# Altium project SEMA_V7 Motor Controller4.12.PrjPcb (part 2 of 2)

## Sheet MOSFET and current Sense.SchDoc
size 431 x 279 mm; SheetNumber: 5; SheetTotal: 6
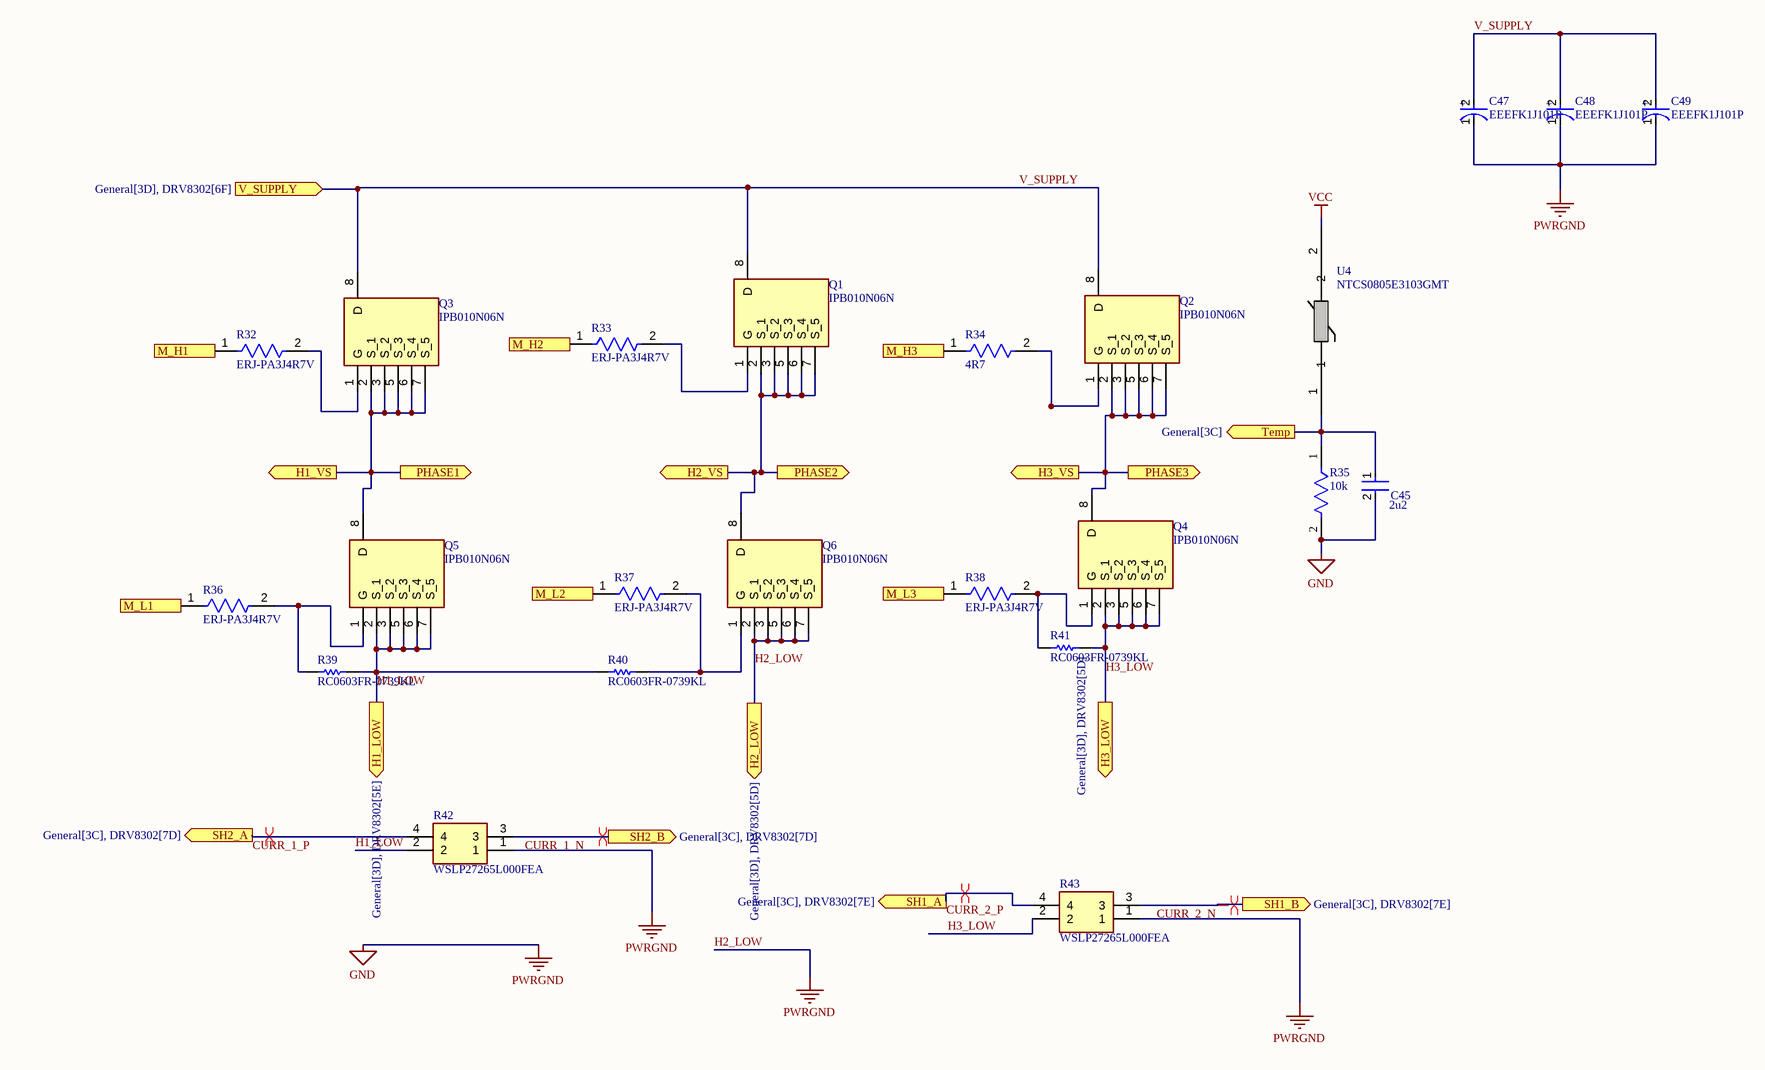
[diagram p3: MOSFET and current Sense.SchDoc]

### Parts
C45  2u2  [FP-GRM188-0_1-e0_2_0_5-MFG]
C47  EEEFK1J101P  [FP-FKG-MFG]
C48  EEEFK1J101P  [FP-FKG-MFG]
C49  EEEFK1J101P  [FP-FKG-MFG]
Q1  IPB010N06N  [PG-TO263-7-3_3]
Q2  IPB010N06N  [PG-TO263-7-3_3]
Q3  IPB010N06N  [PG-TO263-7-3_3]
Q4  IPB010N06N  [PG-TO263-7-3_3]
Q5  IPB010N06N  [PG-TO263-7-3_3]
Q6  IPB010N06N  [PG-TO263-7-3_3]
R32  ERJ-PA3J4R7V  [FP-ERJPA3-IPC_C]
R33  ERJ-PA3J4R7V  [FP-ERJPA3-IPC_C]
R34  4R7  [FP-ERJPA3-IPC_C]
R35  10k  [FP-ERA3A-IPC_C]
R36  ERJ-PA3J4R7V  [FP-ERJPA3-IPC_C]
R37  ERJ-PA3J4R7V  [FP-ERJPA3-IPC_C]
R38  ERJ-PA3J4R7V  [FP-ERJPA3-IPC_C]
R39  RC0603FR-0739KL  [RESC1608X55X25LL10T15]
R40  RC0603FR-0739KL  [RESC1608X55X25LL10T15]
R41  RC0603FR-0739KL  [RESC1608X55X25LL10T15]
R42  WSLP27265L000FEA  [WSLP27265L000FEA]
R43  WSLP27265L000FEA  [WSLP27265L000FEA]
U4  NTCS0805E3103GMT  [NTCS0805_VIS]

### Ports
H1_LOW (out, see General[3D], DRV8302[5E]), H1_VS (out, see General[3D], DRV8302[4C]), H2_LOW (out, see General[3D], DRV8302[5D]), H2_VS (out, see General[3D], DRV8302[4C]), H3_LOW (out, see General[3D], DRV8302[5D]), H3_VS (out, see General[3D], DRV8302[4C]), M_H1 (in, see General[3D], DRV8302[5E]), M_H2 (in, see General[3D], DRV8302[5E]), M_H3 (in, see General[3D], DRV8302[5D]), M_L1 (in, see General[3D], DRV8302[5E]), M_L2 (in, see General[3D], DRV8302[5D]), M_L3 (in, see General[3D], DRV8302[5D]), PHASE1 (out, see General[2D]), PHASE2 (out, see General[2D]), PHASE3 (out, see General[2D]), SH1_A (out, see General[3C], DRV8302[7E]), SH1_B (out, see General[3C], DRV8302[7E]), SH2_A (out, see General[3C], DRV8302[7D]), SH2_B (out, see General[3C], DRV8302[7D]), Temp (out, see General[3C]), V_SUPPLY (in, see General[3D], DRV8302[6F])

### Nets
H2_LOW: C45.2 C47.1(C) C48.1(C) C49.1(C) Q6.2(S_1) Q6.3(S_2) Q6.5(S_3) Q6.6(S_4) Q6.7(S_5) R35.2 R42.1 R43.1 ; port H2_LOW  [also labelled GND, PWRGND]
VCC: U4.2
CURR_1_N: R42.3 ; port SH2_B
CURR_1_P: R42.4 ; port SH2_A
CURR_2_N: R43.3 ; port SH1_B
CURR_2_P: R43.4 ; port SH1_A
H1_LOW: Q5.2(S_1) Q5.3(S_2) Q5.5(S_3) Q5.6(S_4) Q5.7(S_5) R39.2 R40.1 R42.2 ; port H1_LOW
H1_VS: Q3.2(S_1) Q3.3(S_2) Q3.5(S_3) Q3.6(S_4) Q3.7(S_5) Q5.8(D) ; port H1_VS, port PHASE1
H2_VS: Q1.2(S_1) Q1.3(S_2) Q1.5(S_3) Q1.6(S_4) Q1.7(S_5) Q6.8(D) ; port H2_VS, port PHASE2
H3_LOW: Q4.2(S_1) Q4.3(S_2) Q4.5(S_3) Q4.6(S_4) Q4.7(S_5) R41.2 R43.2 ; port H3_LOW
H3_VS: Q2.2(S_1) Q2.3(S_2) Q2.5(S_3) Q2.6(S_4) Q2.7(S_5) Q4.8(D) ; port H3_VS, port PHASE3
V_SUPPLY: C47.2(A) C48.2(A) C49.2(A) Q1.8(D) Q2.8(D) Q3.8(D) ; port V_SUPPLY
NetC45_1: C45.1 R35.1 U4.1 ; port Temp
NetQ1_1: Q1.1(G) R33.2
NetQ2_1: Q2.1(G) R34.2
NetQ3_1: Q3.1(G) R32.2
NetQ4_1: Q4.1(G) R38.2 R41.1
NetQ5_1: Q5.1(G) R36.2 R39.1
NetQ6_1: Q6.1(G) R37.2 R40.2
NetR32_1: R32.1 ; port M_H1
NetR33_1: R33.1 ; port M_H2
NetR34_1: R34.1 ; port M_H3
NetR36_1: R36.1 ; port M_L1
NetR37_1: R37.1 ; port M_L2
NetR38_1: R38.1 ; port M_L3

### Layout directives
differential pair: CURR_1_N, CURR_1_P, CURR_2_N, CURR_2_P

### Notes on the sheet
- DWG. NO.
- REV.
- SHT.
- THIS DOCUMENT AND THE DATA DISCLOSED HEREIN OR HEREWITH IS THE PROPERTY OF ALTIUM LIMITED AND MAY BE FREELY DISTRIBUTED IN WHOLE. NO RIGHTS ARE RESERVED OR EXPRESS OR IMPLIED WARANTEE GIVEN.
- REVISION
- DESCRIPTION
- DATE
- APPROVED
- ENG:
- APPROVALS
- PROJECT
- DSN:
- CHK:
- REFERENCE DOCUMENTS
- PROJECT REVISION:
- TITLE
- DOCUMENT REVISION:
- DESIGN ITEM:
- BOM:
- FAB DWG:
- PCB DWG:
- ASSY DWG:
- SCALE:
- SIZE
- B
- CAGE CODE
- FILE NAME
- DWG NO.
- SHEET
- OF
- REV
- (in symbol CMP-05427-000067-1) +

### Library data of the parts
C45 = CMP-2006-02836-2: Chip Multilayer Ceramic Capacitors for General Purpose, 0603, 2.2uF, X7R, 15%, 10%, 10V; Case Code (Metric): 1608; Height: 0.8mm; Packaging: Cut Tape; Voltage: 10V; Lead Free: Lead Free; Min Operating Temperature: -55°C; Voltage Rating (DC): 10V; Max Operating Temperature: 125°C; Voltage Rating: 10V; Dielectric: X7R; Depth: 0.8mm; Case Code (Imperial): 0603; Termination: SMD/SMT; Case/Package: 0603; Number of Pins: 2; REACH SVHC: No SVHC; Mount: Surface Mount; Width: 0.031inch; Material: Ceramic; Capacitance: 2.2uF; Package Quantity: 1; Weight: 7.1E-05oz; Length: 1.6mm; Thickness: 0.035inch; Tolerance: 10%
C47-C49 = CMP-05427-000067-1: CAP ALUM 100UF 20% 63V SMD; Material: Aluminium; ESR (Equivalent Series Resistance): 350mR; Life (Hours): 2000Hour; Ripple Current (AC): 400mA; Leakage Current: 3uA; Polarity: Polar; Lead Free: Lead Free; Impedance: 350mR; Packaging: Tape and Reel; Voltage Rating (DC): 63V; Construction: Cylindrical; Ripple Current: 400mA; Min Operating Temperature: -55°C; RoHS Compliant: Yes; Dielectric Material: Aluminium; Termination: SMD/SMT; REACH SVHC: No SVHC; Mount: Surface Mount; Radiation Hardening: No; Width: 12mm; Voltage Rating: 63V; Length: 10.2mm; Voltage: 63V; Tolerance: 20%; Series: FK; Diameter: 10mm; Height: 10.2mm; Max Operating Temperature: 105°C; Capacitance: 100uF; Height - Seated (Max): 0.413inch; Case/Package: Radial; Package Quantity: 1; Contact Plating: Tin
Q1-Q6 = IPB010N06N: MOSFET (N-Channel); Manufacturer_Name: Infineon; Datasheet Link: https://www.infineon.com/dgdl/Infineon-IPB010N06N-DS-v02_04-EN.pdf?fileId=db3a3043353fdc1601355341f17a485f; Manufacturer_Part_Number: IPB010N06N; Mouser Part Number: 726-IPB010N06N; Mouser Price/Stock: https://www.mouser.co.uk/ProductDetail/Infineon-Technologies/IPB010N06N?qs=EUA%2Fg8wssK3txpgcjG7wiw%3D%3D
R32-R34 R36-R38 = CMP-05422-000119-1: RES SMD 4.7 OHM 5% 1/4W 0603; Max Power Dissipation: 250mW; Temperature Coefficient: 200ppm/°C; Resistance: 4.7R; Number of Terminations: 2; Resistor Type: Thick Film; Width: 0.031inch; Features: Automotive AEC-Q200; Case/Package: 0603; Height: 0.018inch; Length: 0.063inch; Max Operating Temperature: 155°C; Min Operating Temperature: -55°C; Case Code (Imperial): 0603; Packaging: Tape and Reel; Case Code (Metric): 1608; Tolerance: 5%
R35 = CMP-2000-00874-2: RES SMD 10K OHM 0.1% 1/10W 0603; Voltage Rating (DC): 75V; Power Rating: 100mW; Resistance: 10kR; Temperature Coefficient: 25ppm/°C; Radiation Hardening: No; Width: 0.8mm; Depth: 0.8mm; Construction: Rectangular; Case Code (Metric): 1608; Package Quantity: 5000; Length: 1.6mm; Size Code: 0603; Case Code (Imperial): 0603; Termination: SMD/SMT; Contact Plating: Tin; Resistance Tolerance: 0.1%; Military Standard: Not; Packaging: Tape and Reel; Max Power Dissipation: 100mW; REACH SVHC: No SVHC; Series: ERA-3A; Voltage Rating: 75V; Lead Free: Lead Free; Technology: METAL FILM; RoHS Compliant: Yes; Max Operating Temperature: 155°C; Resistor Type: Thin Film; Min Operating Temperature: -55°C; Number of Pins: 2; Case/Package: 0603; Tolerance: 0.1%; Height: 0.45mm; Mount: Surface Mount; Number of Terminations: 2
R39-R41 = CMP-2000-06940-1: Chip Resistor, 39 KOhm, +/- 1%, 0.1 W, -55 to 155 degC, 0603 (1608 Metric), RoHS, Tape and Reel; Manufacturer: Yageo; Resistance: 39kOhms; Voltage Rating: 50V; Power Rating: 100mW; Temperature Coefficient: 100PPM/C; Product: ThickFilmResistorsGeneralPurpose; Case Code - in: 0603; Tolerance: 1%; Operating Temperature Range: -55Cto+155C; Series: RC; Package Description: 2-Pin Surface Mount Device, Body 1.6 x 0.8 mm; Datasheet URL: http://www.yageo.com/documents/recent/PYu-RC_Group_51_RoHS_L_7.pdf; Package Reference: 0603; Case Code - mm: 1608; Datasheet Version: Rev. 7, 05/2017; Mounting Technology: SurfaceMount; Packaging: Reel; Manufacturer URL: http://www.yageo.com/; Termination Style: SMD/SMT
R42 R43 = WSLP27265L000FEA: Resistor; Manufacturer_Name: Vishay; Datasheet Link: https://componentsearchengine.com/Datasheets/1/WSLP27265L000FEA.pdf; Height: 2.81mm; Manufacturer_Part_Number: WSLP27265L000FEA; Mouser Part Number: 71-WSLP27265L000FEA; Mouser Price/Stock: https://www.mouser.co.uk/ProductDetail/Vishay-Dale/WSLP27265L000FEA?qs=h6V4JsTaLXeHJBxiH6kbIg%3D%3D
U4 = CMP-00030-42801496-1: NTCS0805E3103GMT Thermistor NTC 10K Ohm 2% 2-Pin 0805 Surface Mount Solder Pad 3570K -4 to -3.5 T/R Automotive; Accuracy: 3%; Power Rating: 210mW; Resistance: 10kΩ; Length: 2mm; Schedule B: 8533400080, 8533400080; Radiation Hardening: No; Case Code (Metric): 2012; Packaging: Digi-Reel®; Mount: Surface Mount; Max Operating Temperature: 150°C; Case Code (Imperial): 0805; Tolerance: 2%; Termination: SMD/SMT; Depth: 1.25mm; Max Power Dissipation: 210mW; Contact Plating: Tin; NexarPartId: 42801496; Min Operating Temperature: -40°C; Number of Pins: 2; RoHS: Compliant; Case/Package: 0805

## Sheet HALL_SENSOR_FILTER.SchDoc
size 431 x 279 mm; SheetNumber: 3; SheetTotal: 6
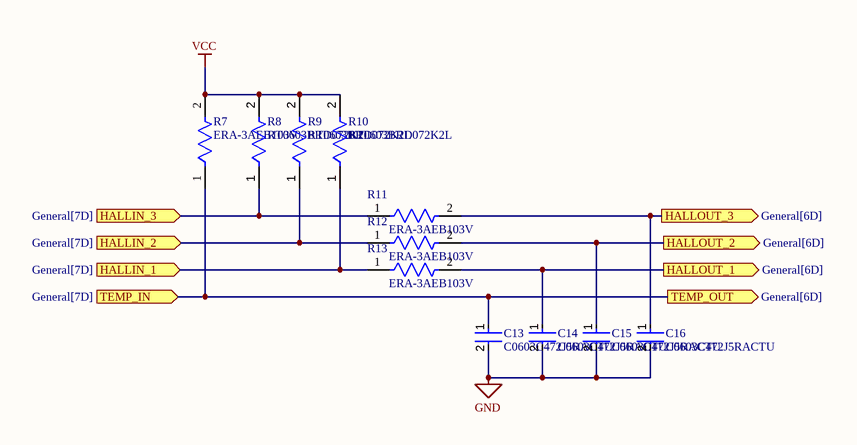
[diagram p4: HALL_SENSOR_FILTER.SchDoc]

### Parts
C13  C0603C472J5RACTU  [FP-C0603C-CF-MFG]
C14  C0603C472J5RACTU  [FP-C0603C-CF-MFG]
C15  C0603C472J5RACTU  [FP-C0603C-CF-MFG]
C16  C0603C472J5RACTU  [FP-C0603C-CF-MFG]
R7  ERA-3AEB103V  [FP-ERA3A-IPC_C]
R8  RT0603BRD072K2L  [FP-RT0603-MFG]
R9  RT0603BRD072K2L  [FP-RT0603-MFG]
R10  RT0603BRD072K2L  [FP-RT0603-MFG]
R11  ERA-3AEB103V  [FP-ERA3A-IPC_C]
R12  ERA-3AEB103V  [FP-ERA3A-IPC_C]
R13  ERA-3AEB103V  [FP-ERA3A-IPC_C]

### Ports
HALLIN_1 (in, see General[7D]), HALLIN_2 (in, see General[7D]), HALLIN_3 (in, see General[7D]), HALLOUT_1 (out, see General[6D]), HALLOUT_2 (out, see General[6D]), HALLOUT_3 (out, see General[6D]), TEMP_IN (in, see General[7D]), TEMP_OUT (out, see General[6D])

### Nets
GND: C13.2 C14.2 C15.2 C16.2  [project net H2_LOW]
VCC: R7.2 R8.2 R9.2 R10.2
NetC13_1: C13.1 R7.1 ; port TEMP_IN, port TEMP_OUT
NetC14_1: C14.1 R13.2 ; port HALLOUT_1
NetC15_1: C15.1 R12.2 ; port HALLOUT_2
NetC16_1: C16.1 R11.2 ; port HALLOUT_3
NetJ3_2: R10.1 R13.1 ; port HALLIN_1
NetJ3_3: R9.1 R12.1 ; port HALLIN_2
NetJ3_4: R8.1 R11.1 ; port HALLIN_3

### Notes on the sheet
- DWG. NO.
- REV.
- SHT.
- THIS DOCUMENT AND THE DATA DISCLOSED HEREIN OR HEREWITH IS THE PROPERTY OF ALTIUM LIMITED AND MAY BE FREELY DISTRIBUTED IN WHOLE. NO RIGHTS ARE RESERVED OR EXPRESS OR IMPLIED WARANTEE GIVEN.
- REVISION
- DESCRIPTION
- DATE
- APPROVED
- ENG:
- APPROVALS
- PROJECT
- DSN:
- CHK:
- REFERENCE DOCUMENTS
- PROJECT REVISION:
- TITLE
- DOCUMENT REVISION:
- DESIGN ITEM:
- BOM:
- FAB DWG:
- PCB DWG:
- ASSY DWG:
- SCALE:
- SIZE
- B
- CAGE CODE
- FILE NAME
- DWG NO.
- SHEET
- OF
- REV

### Library data of the parts
C13-C16 = CMP-1035-02202-3: C0603C 4.7nF Ceramic Multilayer Capacitor; 50 VDC; +125degC; X7R Dielec; +/-5%; Manufacturer: KEMET; Tolerance: 0.05; Capacitance: 4,700 pF; Temperature Coefficient: 30ppm/°C; Value: 4,700 pF; Automotive Grade: Grade 1; Voltage Rating: 50 V; Description: C0603 4,700 pF X7R 30ppm/°C 5.00% 50 V; Device Class L2: Capacitors; Temperature Range Low: -55°C; Automotive: Yes; Manufacturer Part Number: C0603C472J5RACTU; Height: 0.87mm; ComponentLink2Description: Datasheet; Mouser Description: Multilayer Ceramic Capacitors MLCC - SMD/SMT 50volts 4700pF X7R 5%; Material: Ceramic; Device Class L3: Ceramic Capacitors; Device Class L1: Passive Components; Category: Cap; Temperature: -55°C to +125°C; Octopart: https://octopart.com/c0603c472j5ractu-kemet-107195; Digikey Description: C0603C 4.7nF Ceramic Multilayer Capacitor; 50 VDC; +125degC; X7R Dielec; +/-5%; Package: C0603C-CF; Lead Free: Yes; RoHS: TRUE; ComponentLink2URL: https://api.kemet.com/component-edge/download/datasheet/C0603C100J5GACAUTO.pdf; Temperature Range High: +125°C; Temperature Characteristic: X7R
R7 R11-R13 = CMP-2000-00874-2: as R35 on sheet MOSFET and current Sense; Radiation Hardening: No; Width: 0.8mm; Depth: 0.8mm; Construction: Rectangular; Case Code (Metric): 1608; Package Quantity: 5000; Length: 1.6mm; Size Code: 0603; Case Code (Imperial): 0603; Termination: SMD/SMT; Contact Plating: Tin; Resistance Tolerance: 0.1%; Military Standard: Not; Packaging: Tape and Reel; Max Power Dissipation: 100mW; REACH SVHC: No SVHC; Series: ERA-3A; Voltage Rating: 75V; Lead Free: Lead Free; Technology: METAL FILM; RoHS Compliant: Yes; Max Operating Temperature: 155°C; Resistor Type: Thin Film; Min Operating Temperature: -55°C; Number of Pins: 2; Case/Package: 0603; Tolerance: 0.1%; Height: 0.45mm; Mount: Surface Mount; Number of Terminations: 2
R8-R10 = CMP-2000-04423-2: RES 2.20K OHM 1/10W .1% SMD 0603; Manufacturer: Yageo; Power Rating: 0.1W; Tolerance: 0.001; Value: 2.2KΩ; Voltage Rating: 75V; Temperature Coefficient: 25 ppm/°C; Description: RT0603 2.2KΩ 0.1W 25 ppm/°C 0.10%; Series: RT; Manufacturer Part Number: RT0603BRD072K2L; ComponentLink2URL: http://www.yageo.com/documents/recent/PYu-RT_1-to-0.01_RoHS_L_9.pdf; Octopart: https://octopart.com/rt0603brd072k2l-yageo-1186019; Digikey Description: RES 2.20K OHM 1/10W .1% SMD 0603; Device Class L1: Passive Components; Temperature: -55°C to +155°C; ComponentLink2Description: Datasheet; Mouser Description: High Precision-High Stability Chip Resistor Thin Film 0603 2.2kOhm 0.1% Paper T/R; RoHS: TRUE; Footprint Url: http://www.yageo.com/exep/pages/download/literatures/PYu-R_Mount_10.pdf; Height: 0.55mm; Device Class L2: Resistors; Temperature Range Low: -55°C; Ipc Land Pattern Name: RESC16080X45; Composition: Thin Film; Lead Free: Yes; Temperature Range High: +155°C; Category: Res; Automotive: No; Resistance: 2.2KΩ; Package: RT0603; Device Class L3: Chip SMD Resistors

## Sheet CAn tranceiver.SchDoc
size 431 x 279 mm; SheetNumber: 6; SheetTotal: 6
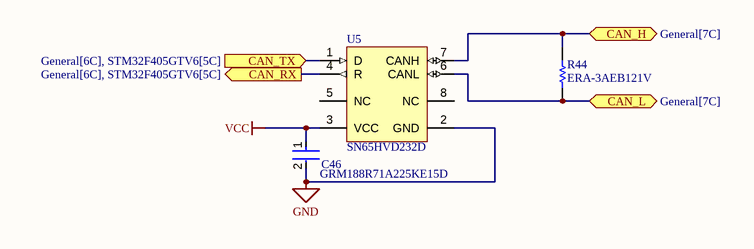
[diagram p5: CAn tranceiver.SchDoc]

### Parts
C46  GRM188R71A225KE15D  [FP-GRM188-0_1-e0_2_0_5-MFG]
R44  ERA-3AEB121V  [RESC1608X55X30NL20T20]
U5  SN65HVD232D  [D0008A_L]

### Ports
CAN_H (bidir, see General[7C]), CAN_L (bidir, see General[7C]), CAN_RX (out, see General[6C], STM32F405GTV6[5C]), CAN_TX (in, see General[6C], STM32F405GTV6[5C])

### Nets
GND: C46.2 U5.2(GND)  [project net H2_LOW]
VCC: C46.1 U5.3(VCC)
CAN_N: R44.2 U5.6(CANL) ; port CAN_L
CAN_P: R44.1 U5.7(CANH) ; port CAN_H
NetU1_61: U5.4(R) ; port CAN_RX
NetU1_62: U5.1(D) ; port CAN_TX

Not connected (* = marked no-connect by the designer): U5 5(NC) 8(NC)

### Notes on the sheet
- DWG. NO.
- REV.
- SHT.
- THIS DOCUMENT AND THE DATA DISCLOSED HEREIN OR HEREWITH IS THE PROPERTY OF ALTIUM LIMITED AND MAY BE FREELY DISTRIBUTED IN WHOLE. NO RIGHTS ARE RESERVED OR EXPRESS OR IMPLIED WARANTEE GIVEN.
- REVISION
- DESCRIPTION
- DATE
- APPROVED
- ENG:
- APPROVALS
- PROJECT
- DSN:
- CHK:
- REFERENCE DOCUMENTS
- PROJECT REVISION:
- TITLE
- DOCUMENT REVISION:
- DESIGN ITEM:
- BOM:
- FAB DWG:
- PCB DWG:
- ASSY DWG:
- SCALE:
- SIZE
- B
- CAGE CODE
- FILE NAME
- DWG NO.
- SHEET
- OF
- REV

### Library data of the parts
C46 = CMP-2006-02836-2: as C45 on sheet MOSFET and current Sense; Case Code (Metric): 1608; Height: 0.8mm; Packaging: Cut Tape; Voltage: 10V; Lead Free: Lead Free; Min Operating Temperature: -55°C; Voltage Rating (DC): 10V; Max Operating Temperature: 125°C; Voltage Rating: 10V; Dielectric: X7R; Depth: 0.8mm; Case Code (Imperial): 0603; Termination: SMD/SMT; Case/Package: 0603; Number of Pins: 2; REACH SVHC: No SVHC; Mount: Surface Mount; Width: 0.031inch; Material: Ceramic; Capacitance: 2.2uF; Package Quantity: 1; Weight: 7.1E-05oz; Length: 1.6mm; Thickness: 0.035inch; Tolerance: 10%
R44 = CMP-2000-00896-1: Manufacturer: Panasonic; Part Number: ERA-3AEB121V
U5 = CMP-0315-00073-2: 3.3 V CAN Transceiver, 17 mA, -40 to 85 degC, 8-pin SOIC (D), Green (RoHS & no Sb/Br); Manufacturer: Texas Instruments; Supply Voltage(s)(V): 3.3; Transient Pulse Protection(V): -25 to 25; ICC(Max)(mA): 17; Drivers Per Package: 1; Rating: Catalog; Code_JEDEC: MS-012AA; Mounting Technology: Surface Mount; PackageDescription: 8-Pin Plastic Small Outline Integrated Circuit, 4.9 x 3.9 mm, Pitch 1.27 mm Pitch; SubFamily: CAN; PackageVersion: revM, Jun-2011; Isolated: No; DatasheetVersion: SLOS346K; PackageReference: D0008A; Receivers Per Package: 1; Footprint: SN65HVD232; ComponentLink1Description: Datasheet; PartNumber: SN65HVD232D; Eco-Plan: Green (RoHS & no Sb/Br); ComponentLink1URL: http://www.ti.com/general/docs/lit/getliterature.tsp?genericPartNumber=SN65HVD232&fileType=pdf

## Nets that join several sheets
+5: General (J2.2 J3.1 J4.1 J5.1), DRV8302 (6 pins)
H2_LOW: General (12 pins), STM32F405GTV6 (17 pins), DRV8302 (37 pins), MOSFET and current Sense (12 pins), HALL_SENSOR_FILTER (C13.2 C14.2 C15.2 C16.2), CAn tranceiver (C46.2 U5.2)
VCC: General (J5.2 J6.1 R4.2), STM32F405GTV6 (12 pins), DRV8302 (6 pins), MOSFET and current Sense (U4.2), HALL_SENSOR_FILTER (R7.2 R8.2 R9.2 R10.2), CAn tranceiver (C46.1 U5.3)
CAN_N: General (J4.3), CAn tranceiver (R44.2 U5.6)
CAN_P: General (J4.2), CAn tranceiver (R44.1 U5.7)
CURR_1_N: DRV8302 (R22.1), MOSFET and current Sense (R42.3)
CURR_1_P: DRV8302 (R21.1), MOSFET and current Sense (R42.4)
CURR_2_N: DRV8302 (R19.1), MOSFET and current Sense (R43.3)
CURR_2_P: DRV8302 (R16.1), MOSFET and current Sense (R43.4)
H1_LOW: DRV8302 (U2.44), MOSFET and current Sense (8 pins)
H1_VS: General (P3.P?), DRV8302 (C24.2 R26.2 U2.46), MOSFET and current Sense (6 pins)
H2_VS: General (P4.P?), DRV8302 (C25.2 R27.2 U2.41), MOSFET and current Sense (6 pins)
H3_LOW: DRV8302 (U2.34), MOSFET and current Sense (7 pins)
H3_VS: General (P5.P?), DRV8302 (C27.2 R28.2 U2.36), MOSFET and current Sense (6 pins)
NetC1_1: General (C1.1 R1.1), STM32F405GTV6 (U1.57)
NetC2_1: General (J6.4), STM32F405GTV6 (C2.1 U1.7)
NetC13_1: General (J3.5), STM32F405GTV6 (U1.8), HALL_SENSOR_FILTER (C13.1 R7.1)
NetC14_1: STM32F405GTV6 (U1.58), HALL_SENSOR_FILTER (C14.1 R13.2)
NetC15_1: STM32F405GTV6 (U1.59), HALL_SENSOR_FILTER (C15.1 R12.2)
NetC16_1: STM32F405GTV6 (U1.52), HALL_SENSOR_FILTER (C16.1 R11.2)
NetC23_1: STM32F405GTV6 (U1.10), DRV8302 (C23.1 R14.1 R15.2)
NetC45_1: STM32F405GTV6 (U1.17), MOSFET and current Sense (C45.1 R35.1 U4.1)
NetJ3_2: General (J3.2), HALL_SENSOR_FILTER (R10.1 R13.1)
NetJ3_3: General (J3.3), HALL_SENSOR_FILTER (R9.1 R12.1)
NetJ3_4: General (J3.4), HALL_SENSOR_FILTER (R8.1 R11.1)
NetJ5_5: General (J5.5), STM32F405GTV6 (U1.21)
NetJ5_6: General (J5.6), STM32F405GTV6 (U1.22)
NetJ6_2: General (J6.2), STM32F405GTV6 (U1.46)
NetJ6_3: General (J6.3), STM32F405GTV6 (U1.49)
NetR5_2: General (R5.2), STM32F405GTV6 (U1.25)
NetR6_2: General (R6.2), STM32F405GTV6 (U1.24)
NetR26_1: STM32F405GTV6 (U1.16), DRV8302 (R26.1 R31.2)
NetR27_1: STM32F405GTV6 (U1.15), DRV8302 (R27.1 R30.2)
NetR28_1: STM32F405GTV6 (U1.14), DRV8302 (R28.1 R29.2)
NetR32_1: DRV8302 (U2.47), MOSFET and current Sense (R32.1)
NetR33_1: DRV8302 (U2.42), MOSFET and current Sense (R33.1)
NetR34_1: DRV8302 (U2.37), MOSFET and current Sense (R34.1)
NetR36_1: DRV8302 (U2.45), MOSFET and current Sense (R36.1)
NetR37_1: DRV8302 (U2.40), MOSFET and current Sense (R37.1)
NetR38_1: DRV8302 (U2.35), MOSFET and current Sense (R38.1)
NetU1_26: STM32F405GTV6 (U1.26), DRV8302 (U2.26)
NetU1_27: STM32F405GTV6 (U1.27), DRV8302 (U2.25)
NetU1_33: STM32F405GTV6 (U1.33), DRV8302 (U2.12)
NetU1_34: STM32F405GTV6 (U1.34), DRV8302 (U2.22)
NetU1_35: STM32F405GTV6 (U1.35), DRV8302 (U2.20)
NetU1_36: STM32F405GTV6 (U1.36), DRV8302 (U2.18)
NetU1_41: STM32F405GTV6 (U1.41), DRV8302 (U2.21)
NetU1_42: STM32F405GTV6 (U1.42), DRV8302 (U2.19)
NetU1_43: STM32F405GTV6 (U1.43), DRV8302 (U2.17)
NetU1_51: STM32F405GTV6 (U1.51), DRV8302 (U2.16)
NetU1_53: STM32F405GTV6 (U1.53), DRV8302 (U2.6)
NetU1_61: STM32F405GTV6 (U1.61), CAn tranceiver (U5.4)
NetU1_62: STM32F405GTV6 (U1.62), CAn tranceiver (U5.1)
RX_SCL_MOSI: General (J5.4), STM32F405GTV6 (U1.23 U1.29 U1.38)
TX_SDA_NSS: General (J5.3), STM32F405GTV6 (U1.20 U1.30 U1.37)
USB_N: General (R2.2), STM32F405GTV6 (U1.44)
USB_P: General (R3.2), STM32F405GTV6 (U1.45)
V_SUPPLY: General (P2.P?), DRV8302 (15 pins), MOSFET and current Sense (6 pins)